# EAGLE design TSAL_contactor_state_and_accumulator_voltage_measurement_TNN_V1.0 (EAGLE 9.6.2)
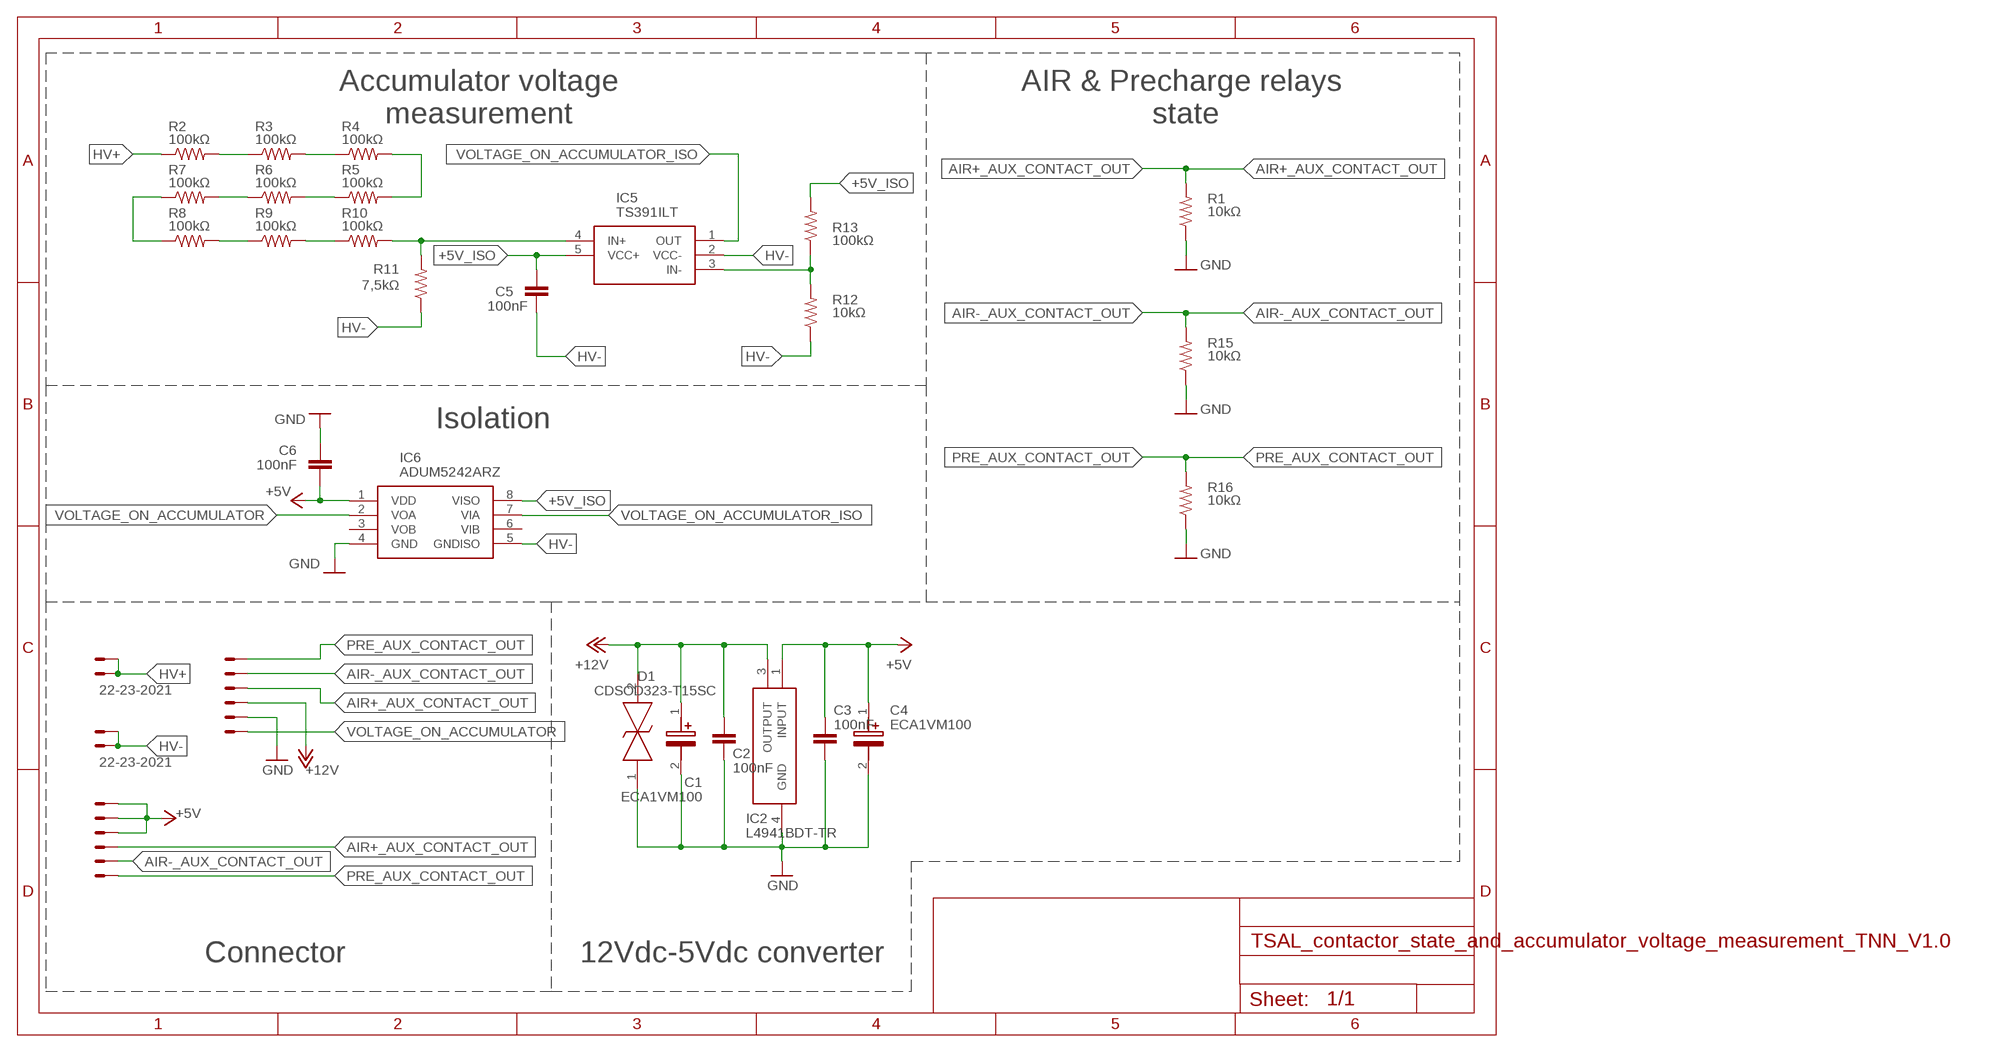
[diagram p0: schematic, sheet 1]

## Parts
AUX_CONTACT  22-23-2061  [22-23-2061]
C1  ECA1VM100  [CAPPRD200W55D525H1200]
C2  100nF  C-EUC0603  [C0603]
C3  100nF  C-EUC0603  [C0603]
C4  ECA1VM100  [CAPPRD200W55D525H1200]
C5  100nF  C-EUC0603  [C0603]
C6  100nF  C-EUC0603  [C0603]
D1  CDSOD323-T15SC  [SOD-323]
HV+  22-23-2021  [22-23-2021]
HV-  22-23-2021  [22-23-2021]
IC2  L4941BDT-TR  [TO228P972X240-3N]
IC5  TS391ILT  [SOT95P280X145-5N]
IC6  ADUM5242ARZ  [SOIC127P600X175-8N]
POWER_AND_TSAL_SIGNAL  22-23-2061  [22-23-2061]
R1  10kΩ  R-US_R0603  [R0603]
R2  100kΩ  R-US_R0603  [R0603]
R3  100kΩ  R-US_R0603  [R0603]
R4  100kΩ  R-US_R0603  [R0603]
R5  100kΩ  R-US_R0603  [R0603]
R6  100kΩ  R-US_R0603  [R0603]
R7  100kΩ  R-US_R0603  [R0603]
R8  100kΩ  R-US_R0603  [R0603]
R9  100kΩ  R-US_R0603  [R0603]
R10  100kΩ  R-US_R0603  [R0603]
R11  7,5kΩ  R-US_R0603  [R0603]
R12  10kΩ  R-US_R0603  [R0603]
R13  100kΩ  R-US_R0603  [R0603]
R15  10kΩ  R-US_R0603  [R0603]
R16  10kΩ  R-US_R0603  [R0603]

## Nets
+5V: AUX_CONTACT.4 AUX_CONTACT.5 AUX_CONTACT.6 C3.1 C4.1(+) C6.1 IC2.1(INPUT) IC6.1(VDD)
+5V_ISO: C5.2 IC5.5(VCC+) IC6.8(VISO) R13.2
+12V: C1.1(+) C2.1 D1.2 IC2.3(OUTPUT) POWER_AND_TSAL_SIGNAL.3
AIR+_AUX_CONTACT_OUT: AUX_CONTACT.3 POWER_AND_TSAL_SIGNAL.4 R1.2
AIR-_AUX_CONTACT_OUT: AUX_CONTACT.2 POWER_AND_TSAL_SIGNAL.5 R15.2
GND: C1.2(-) C2.2 C3.2 C4.2(-) C6.2 D1.1 IC2.4(GND) IC6.4(GND) POWER_AND_TSAL_SIGNAL.2 R1.1 R15.1 R16.1
HV+: HV+.1 HV+.2 R2.1
HV-: C5.1 HV-.1 HV-.2 IC5.2(VCC-) IC6.5(GNDISO) R11.1 R12.1
N$2: R2.2 R3.1
N$3: R3.2 R4.1
N$4: R4.2 R5.2
N$5: R5.1 R6.2
N$6: R6.1 R7.2
N$7: R7.1 R8.1
N$8: R8.2 R9.1
N$9: R9.2 R10.1
N$10: IC5.4(IN+) R10.2 R11.2
N$11: IC5.3(IN-) R12.2 R13.1
PRE_AUX_CONTACT_OUT: AUX_CONTACT.1 POWER_AND_TSAL_SIGNAL.6 R16.2
VOLTAGE_ON_ACCUMULATOR: IC6.2(VOA) POWER_AND_TSAL_SIGNAL.1
VOLTAGE_ON_ACCUMULATOR_ISO: IC5.1(OUT) IC6.7(VIA)
Unconnected: IC6.3(VOB) IC6.6(VIB)

## Notes on the sheet
- Accumulator voltage
  measurement
- AIR & Precharge relays 
  state
- Isolation
- Connector | 12Vdc-5Vdc converter

## Library data of the parts
AUX_CONTACT POWER_AND_TSAL_SIGNAL = con-molex:22-23-2061: .100" (2.54mm) Center Header - 6 Pin; MF: MOLEX; MPN: 22-23-2061; OC_FARNELL: 1462922; OC_NEWARK: 27C1933
C1 C4 = ECA1VM100:ECA1VM100: M radial Al elect cap,10uF 35V 85deg C Panasonic 10uF 35 V dc Aluminium Electrolytic Capacitor, M Series 2000h Source: Datasheet <http://industrial.panasonic.com/cdbs/www-data/pdf/RDF0000/ABA0000C1218.pdf>; DESCRIPTION: M radial Al elect cap,10uF 35V 85deg C Panasonic 10uF 35 V dc Aluminium Electrolytic Capacitor, M Series 2000h; HEIGHT: 12mm; MANUFACTURER_NAME: Panasonic; MANUFACTURER_PART_NUMBER: ECA1VM100
C2 C3 C5 C6 = rcl:C-EU: CAPACITOR, European symbol; SPICEPREFIX: C
D1 = CDSOD323-T15SC:CDSOD323-T15SC: TVS Diode ESD 15V BiDirectional SOD323 Bourns CDSOD323-T15SC Bi-Directional TVS Diode, 400W peak, 2-Pin SOD-323 Source: Datasheet <https://datasheet.datasheetarchive.com/originals/distributors/Datasheets-DGA26/1841678.pdf>; ARROW_PART_NUMBER: CDSOD323-T15SC; ARROW_PRICE-STOCK: https://www.arrow.com/en/products/cdsod323-t15sc/bourns?region=nac; DESCRIPTION: TVS Diode ESD 15V BiDirectional SOD323 Bourns CDSOD323-T15SC Bi-Directional TVS Diode, 400W peak, 2-Pin SOD-323; HEIGHT: mm; MANUFACTURER_NAME: Bourns; MANUFACTURER_PART_NUMBER: CDSOD323-T15SC; MOUSER_PART_NUMBER: 652-CDSOD323-T15SC; MOUSER_PRICE-STOCK: https://www.mouser.co.uk/ProductDetail/Bourns/CDSOD323-T15SC?qs=6S5Watp5UnLvz%2FtnS7XuhA%3D%3D
HV+ HV- = con-molex:22-23-2021: .100" (2.54mm) Center Header - 2 Pin; MF: MOLEX; MPN: 22-23-2021; OC_FARNELL: 1462926; OC_NEWARK: 25C3832
IC2 = L4941BDT-TR:L4941BDT-TR: L4941BDT-TR, Low Dropout Voltage Regulator, 1A, 5 V +/-4%, 3-Pin DPAK Source: Datasheet <http://www.st.com/web/en/resource/technical/document/datasheet/CD00000443.pdf>; ARROW_PART_NUMBER: L4941BDT-TR; ARROW_PRICE-STOCK: https://www.arrow.com/en/products/l4941bdt-tr/stmicroelectronics?region=nac; DESCRIPTION: L4941BDT-TR, Low Dropout Voltage Regulator, 1A, 5 V +/-4%, 3-Pin DPAK; HEIGHT: 2.4mm; MANUFACTURER_NAME: STMicroelectronics; MANUFACTURER_PART_NUMBER: L4941BDT-TR; MOUSER_PART_NUMBER: 511-L4941BDT-TR; MOUSER_PRICE-STOCK: https://www.mouser.co.uk/ProductDetail/STMicroelectronics/L4941BDT-TR?qs=tPFdqECvbMIySYN92F2N4Q%3D%3D
IC5 = TS391ILT:TS391ILT: TS391ILT, Comparator Open Collector 0.3us 12 V, 15 V, 18 V, 24 V, 28 V, 3 V, 5 V, 9 V 5-Pin SOT-23 Source: Datasheet <http://www.st.com/st-web-ui/static/active/en/resource/technical/document/datasheet/CD00001660.pdf>; ARROW_PART_NUMBER: TS391ILT; ARROW_PRICE-STOCK: https://www.arrow.com/en/products/ts391ilt/stmicroelectronics?region=nac; DESCRIPTION: TS391ILT, Comparator Open Collector 0.3us 12 V, 15 V, 18 V, 24 V, 28 V, 3 V, 5 V, 9 V 5-Pin SOT-23; HEIGHT: 1.45mm; MANUFACTURER_NAME: STMicroelectronics; MANUFACTURER_PART_NUMBER: TS391ILT; MOUSER_PART_NUMBER: 511-TS391IL; MOUSER_PRICE-STOCK: https://www.mouser.co.uk/ProductDetail/STMicroelectronics/TS391ILT?qs=P8h1tZw8GcB9GWR61XM17g%3D%3D
IC6 = ADUM5242ARZ:ADUM5242ARZ: Analog Devices ADUM5242ARZ PCB SMT 2-channel Digital Isolator, 2500 V, 8-Pin SOIC Source: Datasheet; ARROW_PART_NUMBER: ADUM5242ARZ; ARROW_PRICE-STOCK: https://www.arrow.com/en/products/adum5242arz/analog-devices; DESCRIPTION: Analog Devices ADUM5242ARZ PCB SMT 2-channel Digital Isolator, 2500 V, 8-Pin SOIC; HEIGHT: mm; MANUFACTURER_NAME: Analog Devices; MANUFACTURER_PART_NUMBER: ADUM5242ARZ; MOUSER_PART_NUMBER: 584-ADUM5242ARZ; MOUSER_PRICE-STOCK: https://www.mouser.co.uk/ProductDetail/Analog-Devices/ADUM5242ARZ?qs=WIvQP4zGanhQ0%252B41E0Savw%3D%3D
R1-R13 R15 R16 = rcl:R-US_: RESISTOR, American symbol; SPICEPREFIX: R

## Board
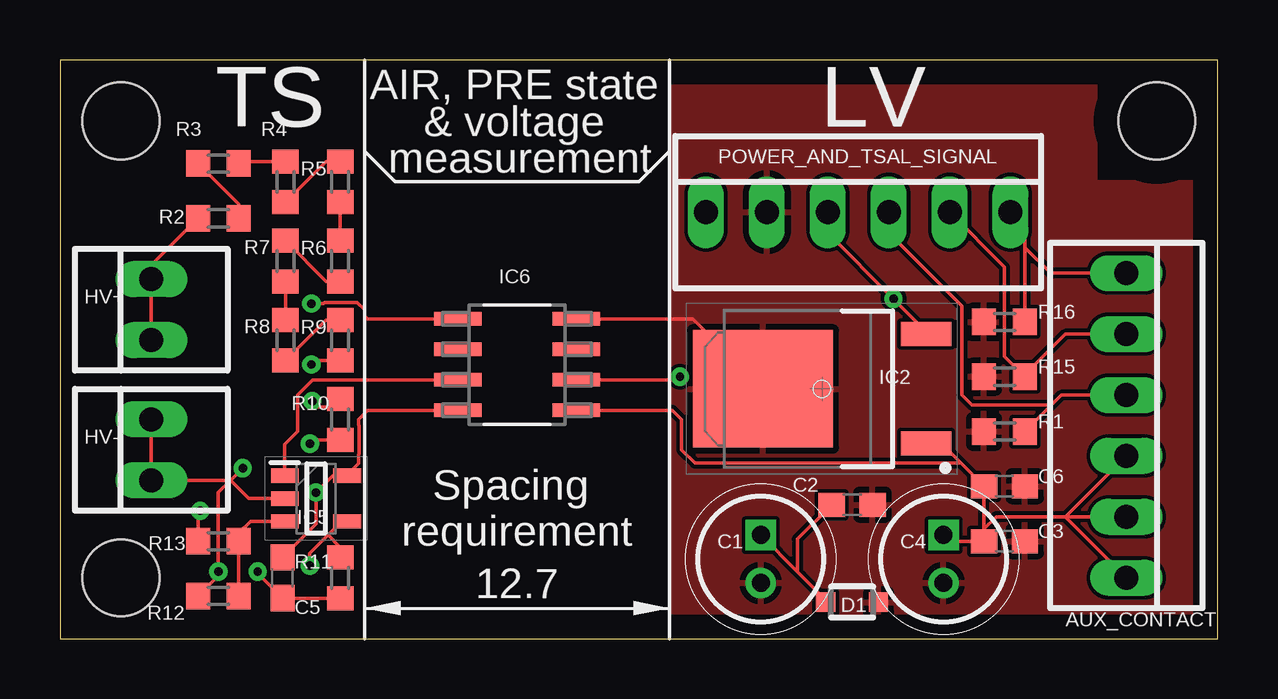
[diagram p1: board, top side]
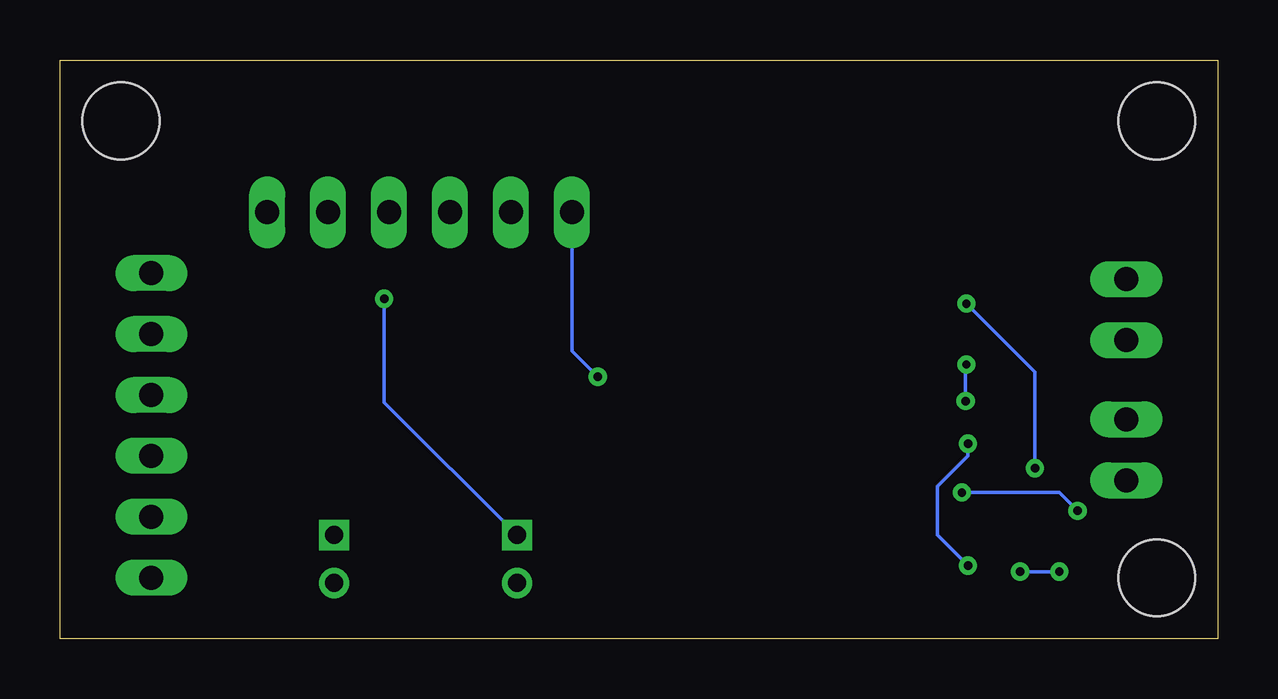
[diagram p2: board, bottom side, seen from below]

Size 48.26 x 24.13 mm. Coordinates in mm from the lower left corner, seen from the top.
Outline: 0,24.13 0,0 48.26,0 48.26,24.13 0,24.13
Copper layers (1*16): Top 0.035mm / dielectric 1.5mm / Bottom 0.035mm
Design rules "default": minimum track width 6mil, minimum drill 0.35mm, track to track 6mil, track to pad 6mil, pad to pad 6mil, via to via 6mil, smd to smd 6mil, copper to edge 40mil, drill to drill 6mil, minimum pad ring 10mil, minimum via ring 8mil, stop-mask expansion 4mil, vias tented up to drill 0mil, thermal gap 10mil
Holes 3.2 mm at 2.54,2.54 2.54,21.59 45.72,21.59

### Footprints (pad centres in the part's own frame; a part is rotated, then mirrored left to right if it is on the bottom)
22-23-2061 = drill 1 long: 1 -6.35,0; 2 -3.81,0; 3 -1.27,0; 4 1.27,0; 5 3.81,0; 6 6.35,0
CAPPRD200W55D525H1200 = drill 0.75 pad 1.15 square: 1 0,0 | drill 0.75 pad 1.15: 2 2,0
C0603 = smd 1.1 x 1: 1 -0.85,0; 2 0.85,0
SOD-323 = smd 0.8 x 0.8: 1 -1.1,0; 2 1.1,0
22-23-2021 = drill 1 long: 1 -1.27,0; 2 1.27,0
TO228P972X240-3N = smd 2.1 x 1: 1 -4.35,2.28; 3 -4.35,-2.28 | smd 5.85 x 4.9: 4 2.45,0
SOT95P280X145-5N = smd 1.15 x 0.6: 1 -1.3,0.95; 2 -1.3,0; 3 -1.3,-0.95; 4 1.3,-0.95; 5 1.3,0.95
SOIC127P600X175-8N = smd 1.981 x 0.559: 1 -2.464,1.905; 2 -2.464,0.635; 3 -2.464,-0.635; 4 -2.464,-1.905; 5 2.464,-1.905; 6 2.464,-0.635; 7 2.464,0.635; 8 2.464,1.905
R0603 = smd 1 x 1.1: 1 -0.85,0; 2 0.85,0

### Placement (x,y rotation side)
AUX_CONTACT  44.45,8.89 270 top
C1  29.21,4.32 270 top
C2  33.02,5.59 0 top
C3  39.37,4.06 0 top
C4  36.83,4.32 270 top
C5  9.27,2.54 90 top
C6  39.37,6.35 0 top
D1  33.02,1.52 180 top
HV+  3.81,13.72 90 top
HV-  3.81,7.87 90 top
IC2  31.75,10.41 180 top
IC5  10.67,5.84 0 top
IC6  19.05,11.43 180 top
POWER_AND_TSAL_SIGNAL  33.27,17.78 0 top
R1  39.37,8.64 0 top
R2  6.6,17.53 0 top
R3  6.6,19.81 0 top
R4  9.4,19.05 270 top
R5  11.68,19.05 90 top
R6  11.68,15.75 90 top
R7  9.4,15.75 90 top
R8  9.4,12.45 270 top
R9  11.68,12.45 270 top
R10  11.68,9.14 270 top
R11  11.68,2.54 90 top
R12  6.6,1.78 0 top
R13  6.6,4.06 180 top
R15  39.37,10.92 0 top
R16  39.37,13.21 0 top

### Tracks (layer width: path | path; a pad name or v marks a point on that pad's centre or on a via)
+5V
  Top 0.152: 38.52,4.57 C3.1 37.08,4.06 C4.1 | 38.52,4.57 C6.1 37.55,7.32 | 38.52,4.57 39.03,5.08 41.91,5.08 | AUX_CONTACT.5 41.91,5.08 | AUX_CONTACT.6 41.91,5.08 | AUX_CONTACT.4 41.91,5.08 | IC2.1 36.74,8.13 37.55,7.32 | IC6.1 25.53,9.53 25.91,9.14 25.91,7.87 26.46,7.32 37.55,7.32
+5V_ISO  (via drill 0.35)
  Top 0.152: IC5.5 11.94,6.79 | 11.94,6.79 11.36,6.79 v10.67,6.1 10.67,4.79 C5.2 | R13.2 5.75,5.25 v5.84,5.33 | IC6.8 12.83,9.53 12.45,9.14 12.45,8.91 12.46,8.89 12.46,7.7 12.45,7.68 12.45,7.3 11.94,6.79
  Bottom 0.152: v5.84,5.33 6.6,6.1 v10.67,6.1
+12V  (via drill 0.35)
  Top 0.152: IC2.3 36.1,12.82 v34.74,14.17 32,16.91 POWER_AND_TSAL_SIGNAL.3 | C1.1 30.73,2.79 | 30.73,2.79 31.92,1.61 D1.2 | C2.1 30.73,4.15 30.73,2.79
  Bottom 0.152: v34.74,14.17 34.74,9.85 C1.1
AIR+_AUX_CONTACT_OUT
  Top 0.152: AUX_CONTACT.3 41.74,10.16 41.32,9.74 | 41.32,9.74 R1.2 | 41.32,9.74 38.02,9.74 37.59,10.16 37.59,13.86 34.54,16.91 POWER_AND_TSAL_SIGNAL.4
AIR-_AUX_CONTACT_OUT
  Top 0.152: 40.18,10.97 39.37,11.77 39.37,15.49 POWER_AND_TSAL_SIGNAL.5 | 40.18,10.97 R15.2 | AUX_CONTACT.2 41.91,12.7 40.18,10.97
GND
  Top 0.152: IC6.4 26.38,13.34 IC2.4
  pour Top: 25.4,24.13 25.4,0 48.26,0 48.26,19.05 43.18,19.05 43.18,24.13
HV+
  Top 0.152: HV+.1 HV+.2 3.81,15.58 R2.1
HV-  (via drill 0.35)
  Top 0.152: R11.1 C5.1 8.24,2.72 v8.24,2.79 | 7.11,6.6 HV-.1 HV-.2 | 7.11,6.6 7.87,5.84 IC5.2 | R12.1 6.6,2.63 v6.6,2.79 6.6,6.1 7.11,6.6 | IC6.5 12.83,13.34 12.7,13.46 12.7,13.72 12.39,14.03 11.04,14.03 10.99,13.97 v10.48,13.97 | v7.62,7.11 7.11,6.6
  Bottom 0.152: v8.24,2.79 v6.6,2.79 | v10.48,13.97 7.62,11.11 v7.62,7.11
N$2
  Top 0.152: R2.2 7.45,18.11 R3.1
N$3
  Top 0.152: R3.2 7.54,19.9 R4.1
N$4
  Top 0.152: R4.2 11.1,19.9 R5.2
N$5
  Top 0.152: R5.1 R6.2
N$6
  Top 0.152: R6.1 11.1,14.9 R7.2
N$7
  Top 0.152: R7.1 R8.1
N$8
  Top 0.152: R8.2 11.1,13.3 R9.1
N$9  (via drill 0.35)
  Top 0.152: R9.2 10.64,11.6 v10.48,11.43 | v10.51,9.91 10.77,9.65 11.34,9.65 R10.1
  Bottom 0.152: v10.48,11.43 10.51,11.4 v10.51,9.91
N$10  (via drill 0.35)
  Top 0.152: R10.2 10.58,8.29 v10.41,8.13 | v10.41,3.05 10.41,3.56 11.18,4.32 | 11.18,4.32 11.75,4.89 IC5.4 | R11.2 11.68,3.81 11.18,4.32
  Bottom 0.152: v10.41,8.13 10.41,7.62 11.68,6.35 11.68,4.32 v10.41,3.05
N$11
  Top 0.152: IC5.3 7.94,4.89 7.45,4.41 R13.1 R12.2
PRE_AUX_CONTACT_OUT
  Top 0.152: 40.22,16.32 R16.2 | AUX_CONTACT.1 41.3,15.24 40.22,16.32 | POWER_AND_TSAL_SIGNAL.6 40.22,17.18 40.22,16.32
VOLTAGE_ON_ACCUMULATOR  (via drill 0.35)
  Top 0.152: v25.84,10.92 25.72,10.79 IC6.2
  Bottom 0.152: POWER_AND_TSAL_SIGNAL.1 26.92,12 v25.84,10.92
VOLTAGE_ON_ACCUMULATOR_ISO
  Top 0.152: IC6.7 10.54,10.79 9.91,10.16 9.91,8.64 9.37,8.1 9.37,7.94 9.37,7.62 IC5.1

### Text on the board
tNames: TS | LV | AIR, PRE state / & voltage / measurement | Spacing / requirement